# Altium project UsbToUartConverter.PrjPcb
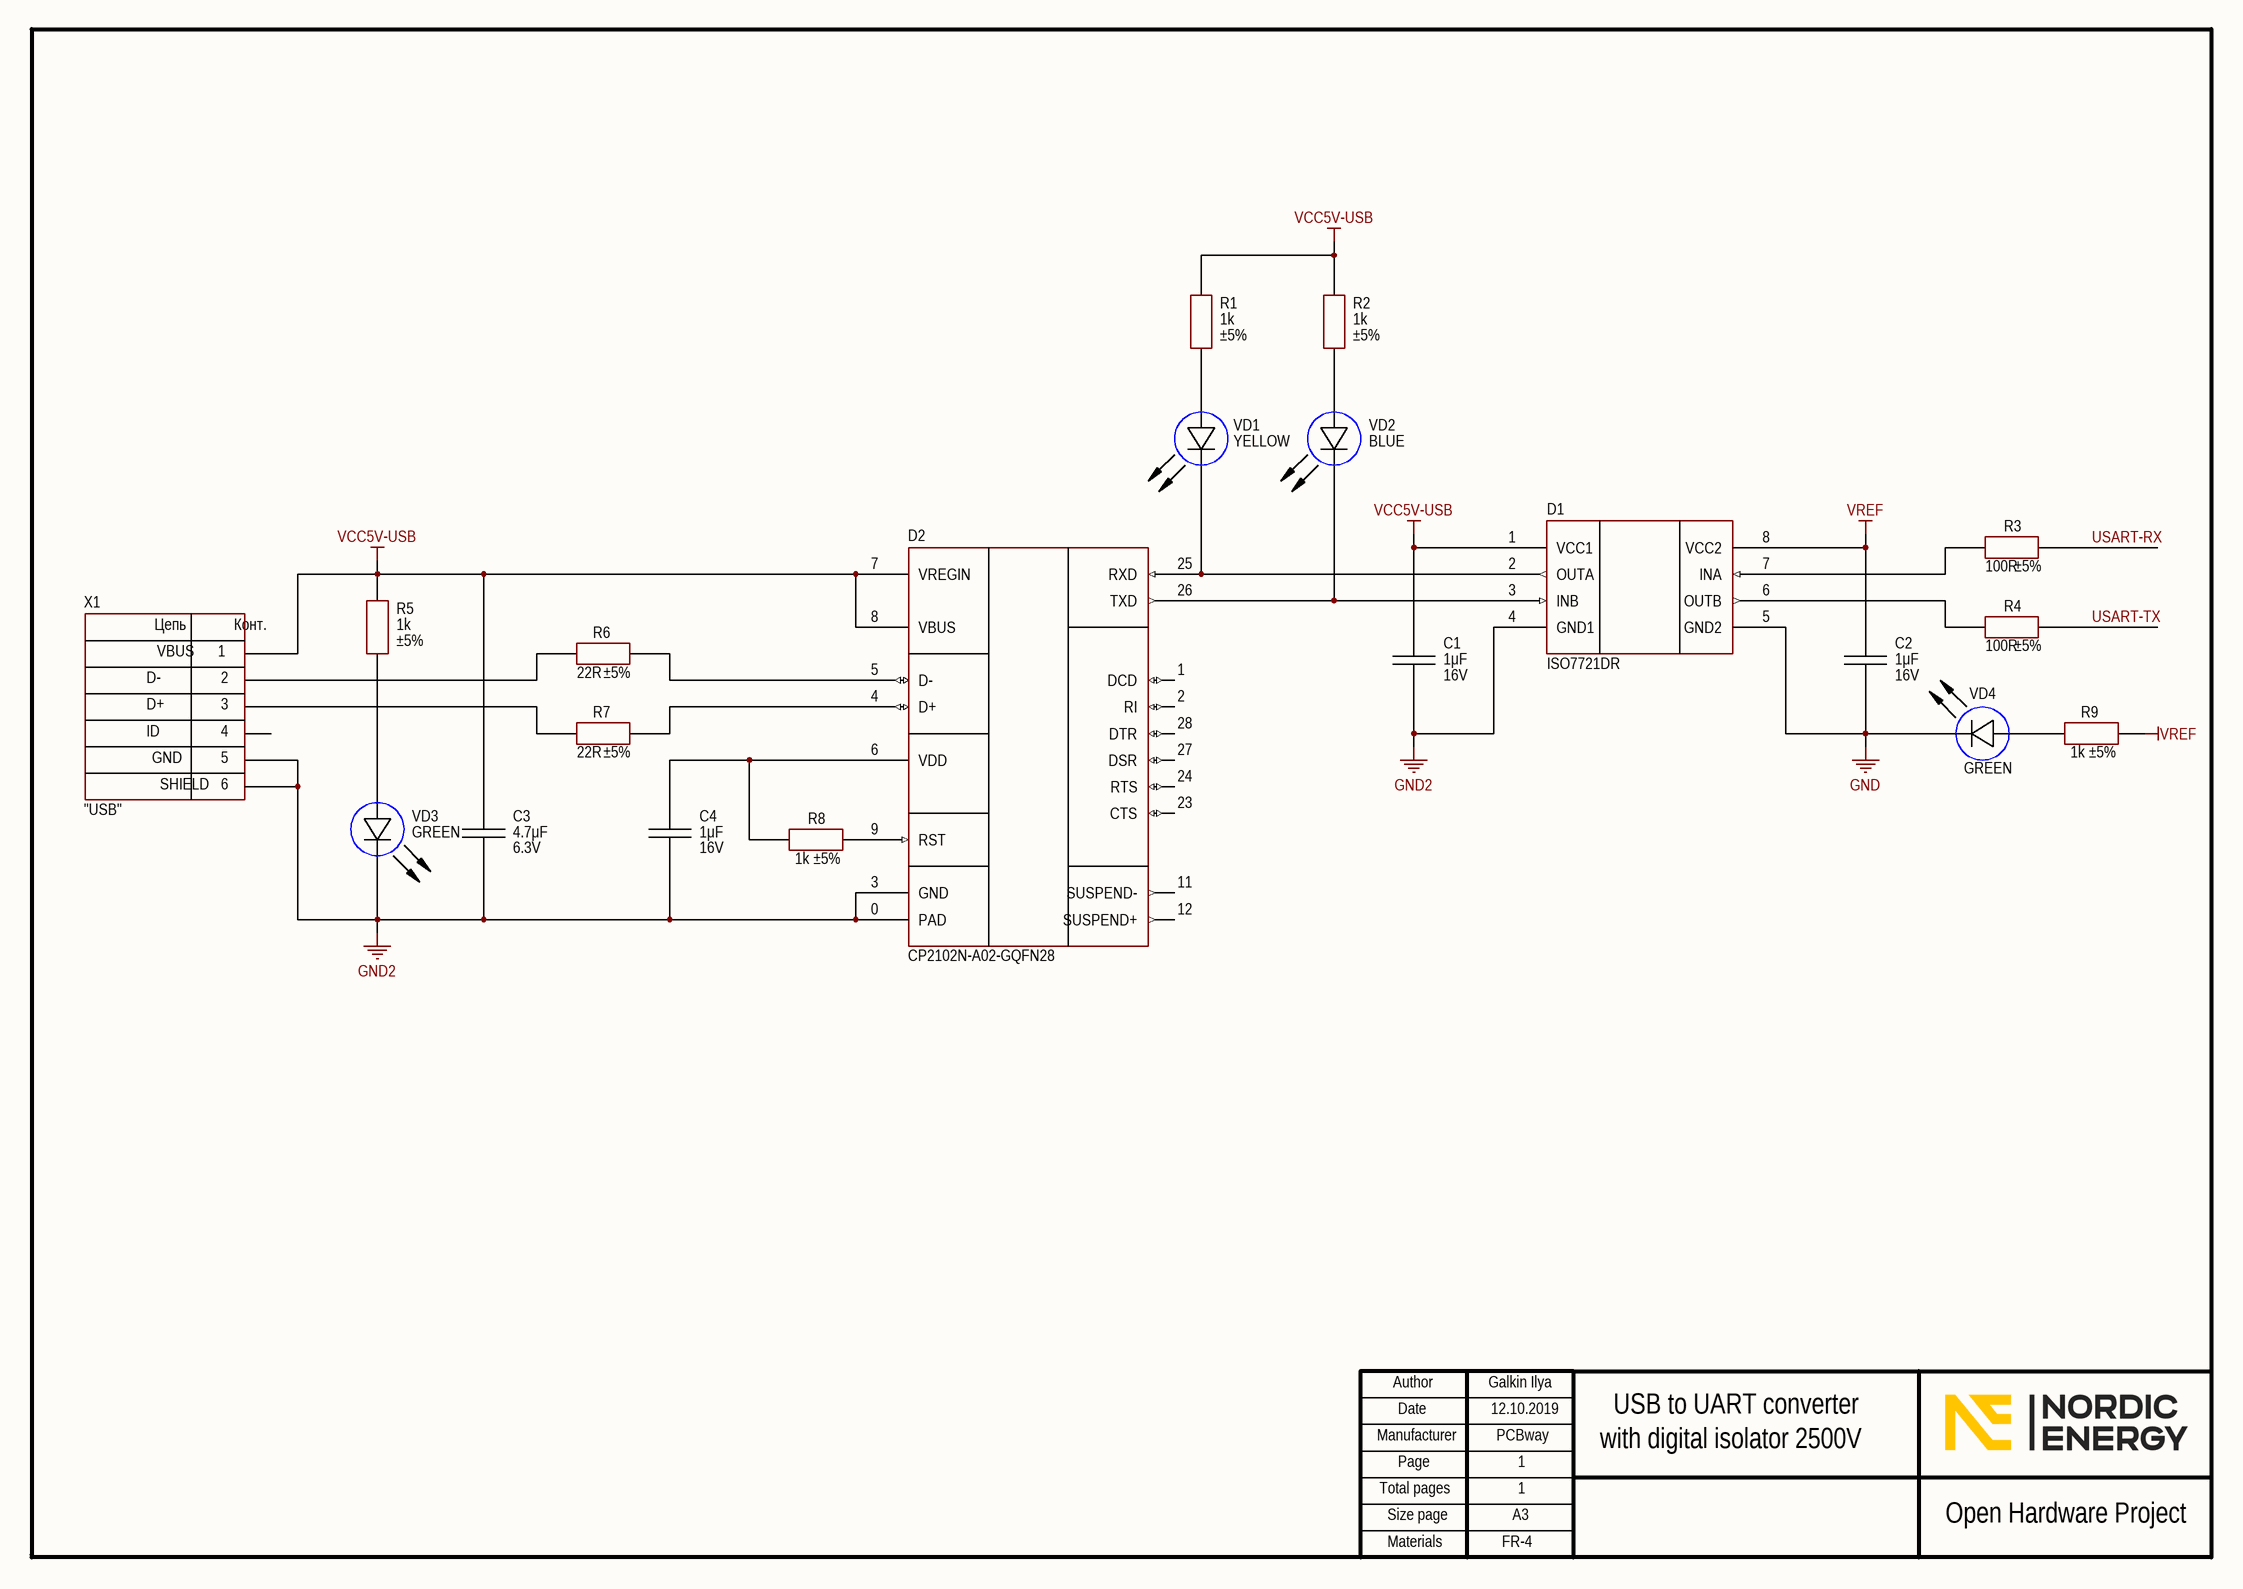
[diagram p0: UsbToUart.SchDoc]
1 sheet, 20 parts. Net scope: global (net labels, ports and power ports of the same name join across sheets).
Board file: PcbForConverter.PcbDoc

## Sheet UsbToUart.SchDoc
size 420 x 297 mm; Address1: Address1; Address2: Address2; Address3: Address3; Address4: Address4; DocumentNumber: АБВГ.123456.001 Э3; SheetNumber: 1; Scale: 1:1; DocumentType: Схема электрическая принципиальная; FirstReferrence: АБВГ.123456.001

### Parts
C1  value 1μF  Voltage: 16V  [CAP: 0603]
C2  value 1μF  Voltage: 16V  [CAP: 0603]
C3  value 4.7μF  Voltage: 6.3V  [CAP: 0603]
C4  value 1μF  Voltage: 16V  [CAP: 0603]
D1  (no value)  [8-SOIC]
D2  PartNumber: CP2102N-A02-GQFN28  [28-QFN (5x5)]
R1  value 1k  Tolerance: ±5%  [RES: 0603]
R2  value 1k  Tolerance: ±5%  [RES: 0603]
R3  value 100R  Tolerance: ±5%  [RES: 0603]
R4  value 100R  Tolerance: ±5%  [RES: 0603]
R5  value 1k  Tolerance: ±5%  [RES: 0603]
R6  value 22R  Tolerance: ±5%  [RES: 0603]
R7  value 22R  Tolerance: ±5%  [RES: 0603]
R8  value 1k  Tolerance: ±5%  [RES: 0603]
R9  value 1k  Tolerance: ±5%  [RES: 0603]
VD1  Color: YELLOW  [LED: 0603Y]
VD2  Color: BLUE  [LED: 0603B]
VD3  Color: GREEN  [LED: 0603G]
VD4  Color: GREEN  [LED: 0603G]
X1  CommentText: "USB"  [CON: USB micro-A (ZX62-B-5PA)]

### Nets
GND: C2.1 D1.5(GND2) VD4.2(C)
GND2: C1.1 C3.1 C4.1 D1.4(GND1) D2.0(PAD) D2.3(GND) VD3.2(C) X1.0 X1.5
VCC5V-USB: C1.2 C3.2 D1.1(VCC1) D2.7(VREGIN) D2.8(VBUS) R1.2 R2.2 R5.2 X1.1
VREF: C2.2 D1.8(VCC2) R9.1
USART-RX: R3.2
USART-TX: R4.2
NetC4_2: C4.2 D2.6(VDD) R8.1
NetD1_2: D1.2(OUTA) D2.25(RXD) VD1.2(C)
NetD1_3: D1.3(INB) D2.26(TXD) VD2.2(C)
NetD1_6: D1.6(OUTB) R4.1
NetD1_7: D1.7(INA) R3.1
NetD2_4: D2.4(D+) R7.2
NetD2_5: D2.5(D-) R6.2
NetD2_9: D2.9(RST) R8.2
NetR1_1: R1.1 VD1.1(A)
NetR2_1: R2.1 VD2.1(A)
NetR5_1: R5.1 VD3.1(A)
NetR6_1: R6.1 X1.2
NetR7_1: R7.1 X1.3
NetR9_2: R9.2 VD4.1(A)

Not connected (* = marked no-connect by the designer): D2 1(DCD) 2(RI) 11(SUSPEND-) 12(SUSPEND+) 23(CTS) 24(RTS) 27(DSR) 28(DTR); X1 4

### Notes on the sheet
- Galkin Ilya
- 12.10.2019
- PCBway
- 1
- with digital isolator 2500V
- USB to UART converter
- FR-4
- Author
- Manufacturer
- Date
- Page
- Total pages
- Size page
- A3
- Open Hardware Project
- Materials
- (in symbol Connector_USB_micro_B) Цепь; Конт.; VBUS; D-; D+; ID; GND; SHIELD; 6

### Library data of the parts
C1 C2 C4 = Ceramic_0603: Manufacturer: Samsung; PartNumber: CL10B105KO8NNNC; ValueManufacturerPartNumber: Ceramic capacitor, 1μF, X7R, ±10%, 16V, 0603, -55...+125°C; TypeCapacitor: Ceramic capacitor; Tolerance: ±10%; TypeDielectric: X7R; Package: 0603; HelpURL: https://www.digikey.com/product-detail/en/samsung-electro-mechanics/CL10B105KO8NNNC/1276-1019-1-ND/3889105; Temperature: -55...+125°C
C3 = Ceramic_0603: Manufacturer: Samsung; PartNumber: CL10B475KQ8NQNC; ValueManufacturerPartNumber: Ceramic capacitor, 4.7μF, X7R, ±10%, 6.3V, 0603, -55...+125°C; TypeCapacitor: Ceramic capacitor; Tolerance: ±10%; TypeDielectric: X7R; Package: 0603; HelpURL: https://www.digikey.com/product-detail/en/samsung-electro-mechanics/CL10B475KQ8NQNC/1276-2087-1-ND/3890173; Temperature: -55...+125°C
D1 = ISO7721DR: Digital isolator; Manufacturer: Texas Instruments; ValueManufacturerPartNumber: IC digital isolator, 100Mbps, 3000Vrms, 2.25...5.5V, -55...+125°C, 8-SOIC; Supply: 2.25...5.5V; DataRate: 100Mbps; Isolation: 3000Vrms; HelpURL: https://www.digikey.com/product-detail/en/texas-instruments/ISO7721DR/296-48296-1-ND/8347715; Package: 8-SOIC; ComponentType: IC digital isolator; Temperature: -55...+125°C; PartNumber: ISO7721DR
D2 = CP2102N: USB-to-UART; Manufacturer: Silicon Labs; ValueManufacturerPartNumber: IC usb-to-uart bridge, USB2.0, 3...3.6V, -40...+85°C, 28-VFQFN; Supply: 3...3.6V; HelpURL: https://www.digikey.com/product-detail/en/silicon-labs/CP2102N-A02-GQFN28/336-5889-ND/9863477; Package: 28-VFQFN; ComponentType: IC usb-to-uart bridge; Temperature: -40...+85°C; Standard: USB2.0
R1 R2 R5 R8 R9 = Resistor_0603: Manufacturer: Yageo; PartNumber: RC0603JR-071KL; ValueManufacturerPartNumber: Resistor film, 1k, ±5%, 0603, 0.1W, -55...+125°C; TypeResistor: Resistor film; Power: 0.1W; Package: 0603; HelpURL: https://www.digikey.com/product-detail/en/yageo/RC0603JR-071KL/311-1.0KGRCT-ND/729624; Temperature: -55...+125°C
R3 R4 = Resistor_0603: Manufacturer: Yageo; PartNumber: RC0603JR-07100RL; ValueManufacturerPartNumber: Resistor film, 100R, ±5%, 0603, 0.1W, -55...+125°C; TypeResistor: Resistor film; Power: 0.1W; Package: 0603; HelpURL: https://www.digikey.com/product-detail/en/yageo/RC0603JR-07100RL/311-100GRCT-ND/729644; Temperature: -55...+125°C
R6 R7 = Resistor_0603: Manufacturer: Yageo; PartNumber: RC0603JR-0722RL; ValueManufacturerPartNumber: Resistor film, 22R, ±5%, 0603, 0.1W, -55...+125°C; TypeResistor: Resistor film; Power: 0.1W; Package: 0603; HelpURL: https://www.digikey.com/product-detail/en/yageo/RC0603JR-0722RL/311-22GRCT-ND/729690; Temperature: -55...+125°C
VD1 = LED_single: Manufacturer: Wurth; ValueManufacturerPartNumber: LED, 20mA, 2V, 0603, -55...+150°C; PartNumber: 150060YS75000; TypeDiode: LED; Current: 20mA; VoltageDrop: 2V; Package: 0603; HelpURL: https://www.digikey.com/product-detail/en/wurth-electronics-inc/150060YS75000/732-4981-1-ND/4489907; Temperature: -55...+150°C
VD2 = LED_single: Manufacturer: Wurth; ValueManufacturerPartNumber: LED, 20mA, 3.2V, 0603, -55...+150°C; PartNumber: 150060BS75000; TypeDiode: LED; Current: 20mA; VoltageDrop: 3.2V; Package: 0603; HelpURL: https://www.digikey.com/product-detail/en/wurth-electronics-inc/150060BS75000/732-4966-1-ND/4489893; Temperature: -55...+150°C
VD3 VD4 = LED_single: Manufacturer: Wurth; ValueManufacturerPartNumber: LED, 20mA, 2V, 0603, -55...+150°C; PartNumber: 150060VS75000; TypeDiode: LED; Current: 20mA; VoltageDrop: 2V; Package: 0603; HelpURL: https://www.digikey.com/product-detail/en/wurth-electronics-inc/150060VS75000/732-4980-1-ND/4489904; Temperature: -55...+150°C
X1 = Connector_USB_micro_B: Manufacturer: Hirose Electric; ValueManufacturerPartNumber: USB micro B; PartNumber: ZX62-B-5PA; HelpURL: https://www.digikey.com/product-detail/en/hirose-electric-co-ltd/ZX62-B-5PA/H11579CT-ND/1851090; TypeConnector: USB micro B